# Altium schematic sheet BSPD.SchDoc: BSPD
size A4; DocumentNumber: 2; Revision: R5; SheetNumber: 2
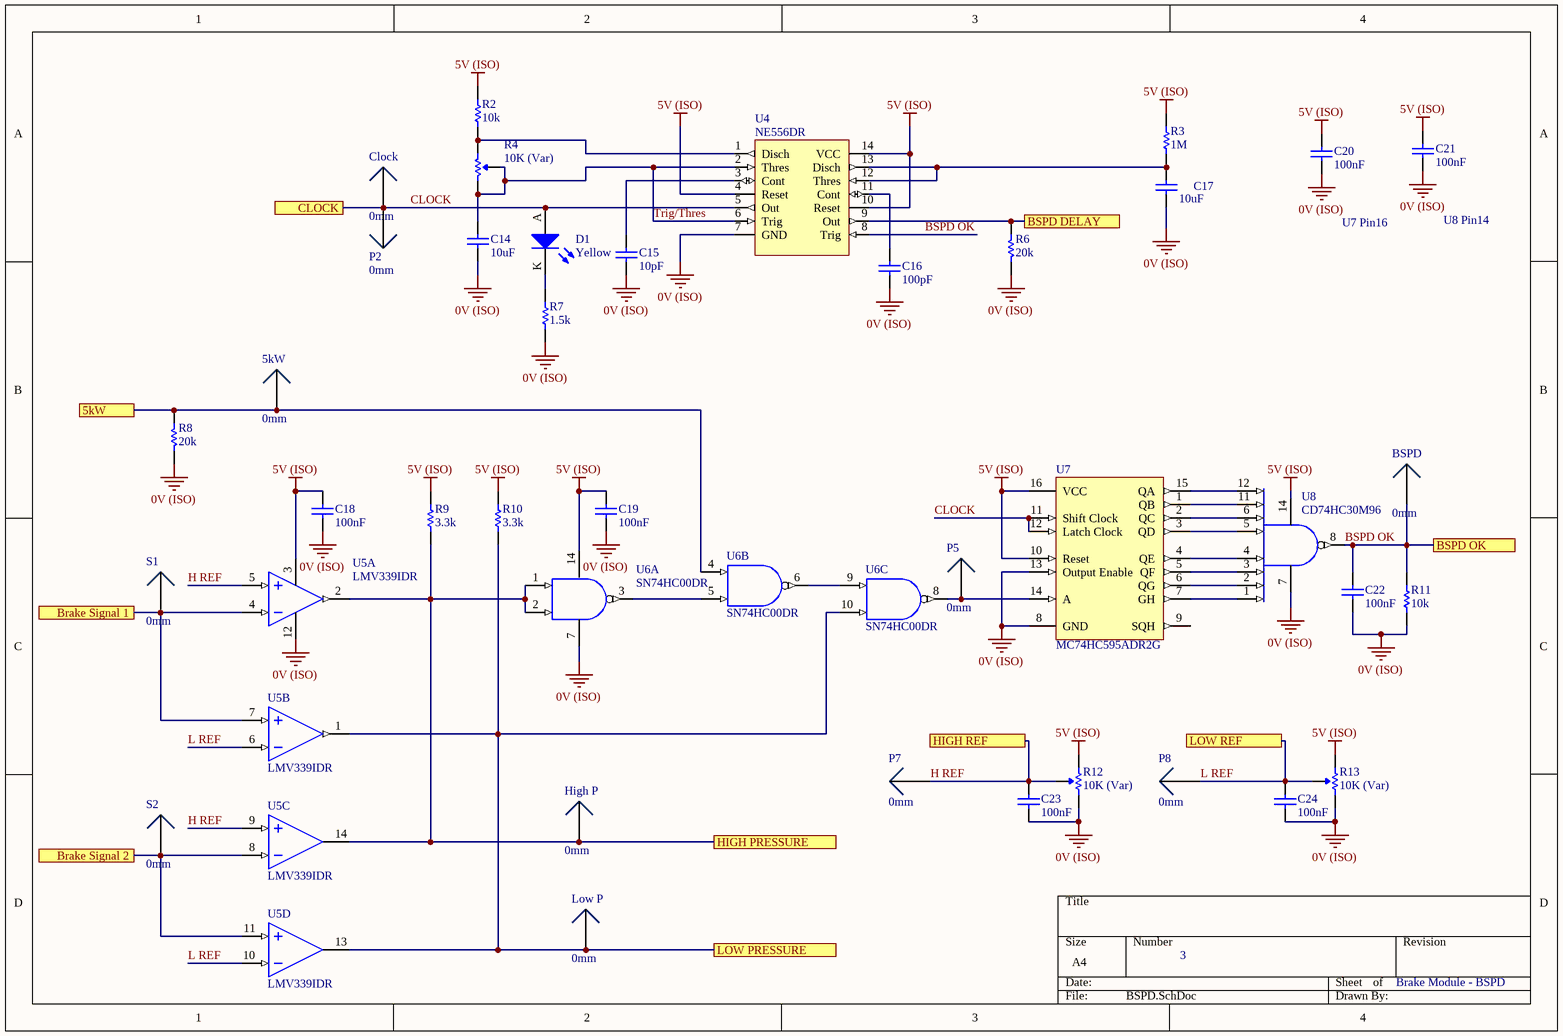
[diagram p0: BSPD.SchDoc]

## Parts
5kW  0mm  [SMD Test Point]
BSPD  0mm  [SMD Test Point]
C14  10uF  [0805]
C15  10pF  [0805]
C16  100pF  [0805]
C17  10uF  [0805]
C18  100nF  [0805]
C19  100nF  [0805]
C20  100nF  [0805]
C21  100nF  [0805]
C22  100nF  [0805]
C23  100nF  [0805]
C24  100nF  [0805]
Clock  0mm  [SMD Test Point]
D1  Yellow  [0805 LED]
High_P  0mm  [SMD Test Point]
Low_P  0mm  [SMD Test Point]
P2  0mm  [TH Test Point]
P5  0mm  [SMD Test Point]
P7  0mm  [TH Test Point]
P8  0mm  [TH Test Point]
R2  10k  [0805]
R3  1M  [0805]
R4  10K (Var)  [B 3296]
R6  20k  [0805]
R7  1.5k  [0805]
R8  20k  [0805]
R9  3.3k  [0805]
R10  3.3k  [0805]
R11  10k  [0805]
R12  10K (Var)  [B 3296]
R13  10K (Var)  [B 3296]
S1  0mm  [TH Test Point]
S2  0mm  [TH Test Point]
U4  NE556DR  [14 SOIC]
U5  LMV339IDR  [TI 14-SOIC]  (parts A,B,C,D of 4)
U6  SN74HC00DR  [TI 14-SOIC]  (parts A,B,C of 4)
U7  MC74HC595ADR2G  [ON 16-SOIC]
U8  CD74HC30M96  [TI 14-SOIC]

## Ports
5kW, Brake Signal 1, Brake Signal 2, BSPD DELAY, BSPD OK, CLOCK, HIGH PRESSURE, HIGH REF, LOW PRESSURE, LOW REF

## Nets
0V (ISO): C14.1 C15.1 C16.1 C17.1 C18.1 C19.1 C20.1 C21.1 C22.1 C23.1 C24.1 R6.2 R7.1 R8.2 R11.1 R12.1(CCW) R13.1(CCW) U4.7(GND) U5.12(V-) U6.7(GND) U7.8(GND) U7.13(Output_Enable) U8.7(GND)
5V (ISO): C18.2 C19.2 C20.2 C21.2 R2.2 R3.2 R9.2 R10.2 R12.3(CW) R13.3(CW) U4.4(Reset) U4.10(Reset) U4.14(VCC) U5.3(V+) U6.14(VCC) U7.10(Reset) U7.16(VCC) U8.14(VCC)
5kW: 5kW.1 R8.1 U6.4(2A) ; port 5kW
Brake Signal 1: S1.1 U5.4(IN_A-) U5.7(IN_B+) ; port Brake Signal 1
Brake Signal 2: S2.1 U5.8(IN_C-) U5.11(IN_D+) ; port Brake Signal 2
BSPD DELAY: R6.1 U4.9(Out) ; port BSPD DELAY
BSPD OK: BSPD.1 C22.2 R11.2 U4.8(Trig) U8.8(Output) ; port BSPD OK
CLOCK: Clock.1 D1.A P2.1 U4.5(Out) U7.11(Shift_Clock) U7.12(Latch_Clock) ; port CLOCK
H REF: C23.2 P7.1 R12.2(Wiper) U5.5(IN_A+) U5.9(IN_C+) ; port HIGH REF
HIGH PRESSURE: High_P.1 R9.1 U5.2(OUT_A) U5.14(OUT_C) U6.1(1A) U6.2(1B) ; port HIGH PRESSURE
L REF: C24.2 P8.1 R13.2(Wiper) U5.6(IN_B-) U5.10(IN_D-) ; port LOW REF
LOW PRESSURE: Low_P.1 R10.1 U5.1(OUT_B) U5.13(OUT_D) U6.10(3B) ; port LOW PRESSURE
Trig/Thres: C14.2 R4.1(CCW) R4.2(Wiper) U4.2(Thres) U4.6(Trig)
NetC15_2: C15.2 U4.3(Cont)
NetC16_2: C16.2 U4.11(Cont)
NetC17_2: C17.2 R3.1 U4.12(Thres) U4.13(Disch)
NetD1_K: D1.K R7.2
NetP5_1: P5.1 U6.8(3Y) U7.14(A)
NetR2_1: R2.1 R4.3(CW) U4.1(Disch)
NetU6_3: U6.3(1Y) U6.5(2B)
NetU6_6: U6.6(2Y) U6.9(3A)
NetU7_1: U7.1(QB) U8.11(Input)
NetU7_2: U7.2(QC) U8.6(Input)
NetU7_3: U7.3(QD) U8.5(Input)
NetU7_4: U7.4(QE) U8.4(Input)
NetU7_5: U7.5(QF) U8.3(Input)
NetU7_6: U7.6(QG) U8.2(Input)
NetU7_7: U7.7(GH) U8.1(Input)
NetU7_15: U7.15(QA) U8.12(Input)

Not connected (* = marked no-connect by the designer): U7 9(SQH)

## Notes on the sheet
- U7 Pin16
- U8 Pin14
- 3
- Brake Module - BSPD

## Library data of the parts
5kW BSPD Clock High_P Low_P P5 = SMD Test Point: Positions: 1; Row Spacing: 0; Flange: No; Contact: NA; Part Number: SMD Test Point; Pitch: 0mm; Angle: 0
C14 C17 = GRM21BR6YA106KE43L: Manufacturer: muRata; Tolerance: 10%; Material: X5R; Rated Voltage: 50V; Part Number: GRM21BR6YA106KE43L; Value: 10uF; Digikey Part Number: 490-10514-6-ND
C15 = GRM21A5C2E100JW01D: Manufacturer: muRata; Tolerance: ±5%; Material: C0G, NP0; Rated Voltage: 250V; Part Number: GRM21A5C2E100JW01D; Value: 10pF; Digikey Part Number: 490-5530-1-ND
C16 = GCM2165C1H101JA16D: Manufacturer: muRata; Tolerance: ±5%; Material: C0G, NP0; Rated Voltage: 50V; Part Number: GCM2165C1H101JA16D; Value: 100pF; Digikey Part Number: 490-8031-1-ND
C18 C20-C24 = GCM21BR71H104KA37L: Manufacturer: muRata; Tolerance: ±10%; Material: X7R; Rated Voltage: 50V; Part Number: GCM21BR71H104KA37L; Value: 100nF; Digikey Part Number: 490-6064-1-ND
C19 = GCM21BR71E104KA37L: Manufacturer: muRata; Tolerance: 10%; Material: X7R; Rated Voltage: 25V; Part Number: GCM21BR71E104KA37L; Value: 100nF; Digikey Part Number: DO NOT USE FOR NEW DESIGNS
D1 = SML-211YTT86: Yellow LED Indication - Discrete 1.75V 0805 (2012 Metric); Manufacturer: ROHM Semiconductor; Part Number: SML-211YTT86; Colour: Yellow; Digikey Part Number: 511-1293-1-ND; Digikey Link: https://www.digikey.com/product-detail/en/rohm-semiconductor/SML-211YTT86/511-1293-1-ND/637106
P2 P7 P8 S1 S2 = TH Test Point: Positions: 1; Angle: 0; Flange: No; Contact: NA; Part Number: TH Test Point; Pitch: 0mm; Row Spacing: 0mm
R2 R11 = RC0805FR0710KL: Manufacturer: YAGEO; Tolerance: 0.01; Rated Voltage: 0.125W; Part Number: RC0805FR0710KL; Value: 10k; Material: FR-07; Digikey Part Number: 311-10.0KCRCT-ND
R3 = RC0805FR071ML: Manufacturer: YAGEO; Tolerance: 0.01; Rated Voltage: 0.125W; Part Number: RC0805FR071ML; Value: 1M; Material: FR-07; Digikey Part Number: 311-1.00MCRCT-ND
R4 R12 R13 = 3296W-1-103LF: Manufacturer: Bournes Inc; Tolerance: 0.1; Rated Voltage: 0.5W; Part Number: 3296W-1-103LF; Value: 10K (Var); Digikey Part Number: 3296W-103LF-ND
R6 R8 = RC0805FR0720KL: Manufacturer: YAGEO; Tolerance: 0.01; Rated Voltage: 0.125W; Part Number: RC0805FR0720KL; Value: 20k; Material: FR-07; Digikey Part Number: 311-20.0KCRCT-ND
R7 = RC0805FR071K5L: Manufacturer: YAGEO; Tolerance: 0.01; Rated Voltage: 0.125W; Part Number: RC0805FR071K5L; Value: 1.5k; Material: FR-07; Digikey Part Number: 311-1.50KCRCT-ND
R9 R10 = RC0805FR073K3L: Manufacturer: YAGEO; Tolerance: 0.01; Rated Voltage: 0.125W; Part Number: RC0805FR073K3L; Value: 3.3k; Material: FR-07; Digikey Part Number: 311-3.30KCRCT-ND
U4 = NE556DR: IC OSC TIMER DUAL 100KHZ 14SOIC; Manufacturer: Texas Instruments; Part Number: NE556DR; Digikey Part Number: 296-26240-1-ND; Digikey Link: https://www.digikey.com/product-detail/en/texas-instruments/NE556DR/296-26240-1-ND/2254905
U5 = LMV339IDR: Comparator General Purpose Open Collector 14-SOIC; Manufacturer: Texas Instruments; Part Number: LMV339IDR; Digikey Part Number: 296-6611-2-ND; Digikey Link: https://www.digikey.com/product-detail/en/texas-instruments/LMV339MTX-NOPB/296-35446-1-ND/3739150
U6 = SN74HC00DR: NAND Gate IC 4 Channel 14-SOIC; Manufacturer: Texas Instruments; Part Number: SN74HC00DR; Digikey Part Number: 296-1187-2-ND; Digikey Link: https://www.digikey.com.au/product-detail/en/texas-instruments/SN74HC00DR/296-1187-2-ND/276830
U7 = MC74HC595ADR2G: IC SHIFT REGISTR 8BIT 3ST 16SOIC; Manufacturer: ON Semiconductor; Part Number: MC74HC595ADR2G; Digikey Part Number: MC74HC595ADR2GOSCT-ND; Digikey Link: https://www.digikey.com/product-detail/en/on-semiconductor/MC74HC595ADR2G/MC74HC595ADR2GOSCT-ND/1139727
U8 = CD74HC30M96: IC GATE NAND 1CH 8-INP 14SOIC; Manufacturer: Texas Instruments; Part Number: CD74HC30M96; Digikey Part Number: 296-14521-1-ND; Digikey Link: https://www.digikey.com/product-detail/en/texas-instruments/CD74HC30M96/296-14521-1-ND/555580